# Altium schematic sheet ESP32_WiFi.SchDoc: BluetoothGateway
size A; DrawnBy: Q.Thang & T.Khoa; Revision: V1.0.0; SheetNumber: 7; SheetTotal: 17
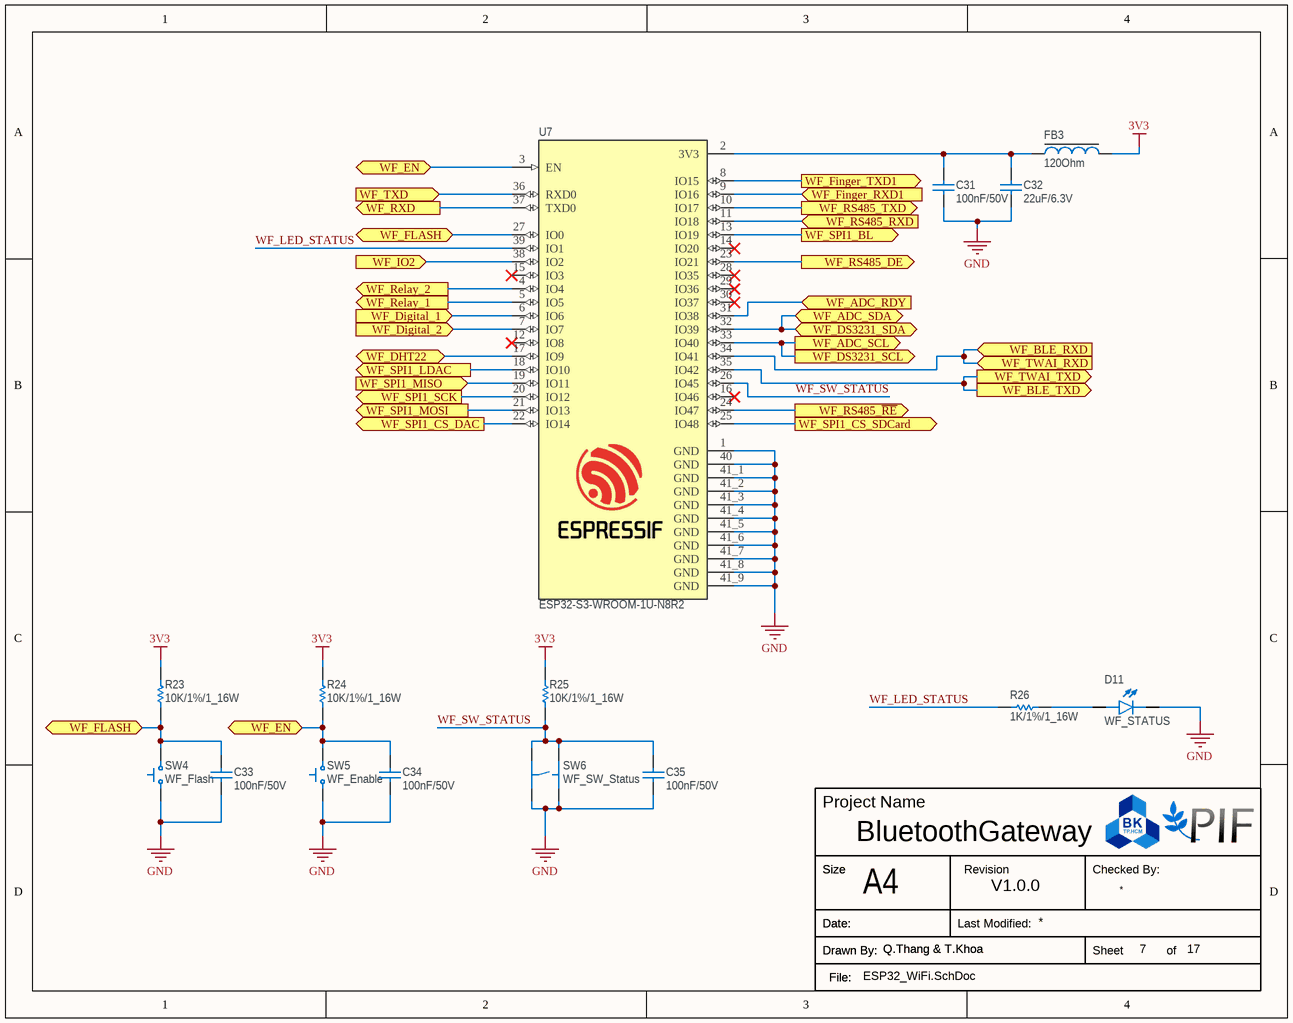
[diagram p0: ESP32_WiFi.SchDoc]

## Parts
C31  100nF/50V  [CAP_0805]
C32  22uF/6.3V  [CAP_0805]
C33  100nF/50V  [CAP_0402]
C34  100nF/50V  [CAP_0402]
C35  100nF/50V  [CAP_0402]
D11  WF_STATUS  [LED_0603Y]
FB3  120Ohm  [Ferrite_Bead_0805]
R23  10K/1%/1_16W  [RESISTOR_0402]
R24  10K/1%/1_16W  [RESISTOR_0402]
R25  10K/1%/1_16W  [RESISTOR_0402]
R26  1K/1%/1_16W  [RESISTOR_0402]
SW4  WF_Flash  [Button_3x4mm_SMD_2P]
SW5  WF_Enable  [Button_3x4mm_SMD_2P]
SW6  WF_SW_Status  [Button_4.5x4.7mm_SMD_4P]
U7  ESP32-S3-WROOM-1U-N8R2  [XCVR_ESP32-S3-WROOM-1U-N16R8]

## Ports
WF_ADC_RDY (in, see Overview_Schematic[6C], DAC_ADC_External[3A]), WF_ADC_SCL (out, see Overview_Schematic[6C], DAC_ADC_External[1A]), WF_ADC_SDA (bidir, see Overview_Schematic[6C], DAC_ADC_External[1A]), WF_BLE_RXD (in, see Overview_Schematic[5B], Communication[3C]), WF_BLE_TXD (out, see Overview_Schematic[5B], Communication[3C]), WF_DHT22 (bidir, see Overview_Schematic[6B], Interface_IO[4C]), WF_Digital_1 (in, see Overview_Schematic[6B], Interface_IO[7A]), WF_Digital_2 (in, see Overview_Schematic[6B], Interface_IO[7B]), WF_DS3231_SCL (out, see Overview_Schematic[6B], Interface_IO[1C]), WF_DS3231_SDA (bidir, see Overview_Schematic[6B], Interface_IO[1C]), WF_EN (bidir, see Overview_Schematic[5A], USB_To_TTL[4D]), WF_Finger_RXD1 (in, see Overview_Schematic[6B], FingerPrint[1B]), WF_Finger_TXD1 (out, see Overview_Schematic[6A], FingerPrint[1B]), WF_FLASH (bidir, see Overview_Schematic[5A], USB_To_TTL[4D]), WF_IO2 (in, see Overview_Schematic[5A], USB_To_TTL[4D]), WF_Relay_1 (out, see Overview_Schematic[6B], Interface_IO[1A]), WF_Relay_2 (out, see Overview_Schematic[6B], Interface_IO[1B]), WF_RS485_DE (out, see Overview_Schematic[6B], UART_RS485[1B]), WF_RS485_RXD (in, see Overview_Schematic[6B], UART_RS485[1B]), WF_RS485_TXD (out, see Overview_Schematic[6B], UART_RS485[1B]), WF_RS485_~{RE} (out, see Overview_Schematic[6B], UART_RS485[1B]), WF_RXD (out, see Overview_Schematic[5A], USB_To_TTL[6C]), WF_SPI1_BL (out, see Overview_Schematic[5C], Display[2D]), WF_SPI1_CS_DAC (out, see Overview_Schematic[5C], DAC_ADC_External[1C]), WF_SPI1_CS_SDCard (out, see Overview_Schematic[5C], Display[2C]), WF_SPI1_LDAC (out, see Overview_Schematic[5C], DAC_ADC_External[1C]), WF_SPI1_MISO (in, see Overview_Schematic[5C], Display[2C]), WF_SPI1_MOSI (out, see Overview_Schematic[5C], DAC_ADC_External[1C], Display[2C]), WF_SPI1_SCK (out, see Overview_Schematic[5C], DAC_ADC_External[1C], Display[2C]), WF_TWAI_RXD (in, see Overview_Schematic[5B]), WF_TWAI_TXD (out, see Overview_Schematic[5B]), WF_TXD (in, see Overview_Schematic[5A], USB_To_TTL[6C])

## Nets
3V3: FB3.2 R23.2 R24.2 R25.2
GND: C31.1 C32.1 C33.1 C34.1 C35.1 D11.C SW4.1 SW5.1 SW6.1 SW6.3 U7.1(GND) U7.40(GND) U7.41_1(GND) U7.41_2(GND) U7.41_3(GND) U7.41_4(GND) U7.41_5(GND) U7.41_6(GND) U7.41_7(GND) U7.41_8(GND) U7.41_9(GND)
WF_ADC_RDY: U7.31(IO38) ; port WF_ADC_RDY
WF_ADC_SCL: U7.33(IO40) ; port WF_ADC_SCL, port WF_DS3231_SCL
WF_ADC_SDA: U7.32(IO39) ; port WF_ADC_SDA, port WF_DS3231_SDA
WF_BLE_RXD: U7.34(IO41) ; port WF_TWAI_RXD, port WF_BLE_RXD
WF_BLE_TXD: U7.35(IO42) ; port WF_TWAI_TXD, port WF_BLE_TXD
WF_DHT22: U7.17(IO9) ; port WF_DHT22
WF_Digital_1: U7.6(IO6) ; port WF_Digital_1
WF_Digital_2: U7.7(IO7) ; port WF_Digital_2
WF_EN: C34.2 R24.1 SW5.2 U7.3(EN) ; port WF_EN
WF_Finger_RXD1: U7.9(IO16) ; port WF_Finger_RXD1
WF_Finger_TXD1: U7.8(IO15) ; port WF_Finger_TXD1
WF_FLASH: C33.2 R23.1 SW4.2 U7.27(IO0) ; port WF_FLASH
WF_IO2: U7.38(IO2) ; port WF_IO2
WF_LED_STATUS: R26.1 U7.39(IO1)
WF_Relay_1: U7.5(IO5) ; port WF_Relay_1
WF_Relay_2: U7.4(IO4) ; port WF_Relay_2
WF_RS485_DE: U7.23(IO21) ; port WF_RS485_DE
WF_RS485_~{RE}: U7.24(IO47) ; port WF_RS485_~{RE}
WF_RS485_RXD: U7.11(IO18) ; port WF_RS485_RXD
WF_RS485_TXD: U7.10(IO17) ; port WF_RS485_TXD
WF_RXD: U7.37(TXD0) ; port WF_RXD
WF_SPI1_BL: U7.13(IO19) ; port WF_SPI1_BL
WF_SPI1_CS_DAC: U7.22(IO14) ; port WF_SPI1_CS_DAC
WF_SPI1_CS_SDCard: U7.25(IO48) ; port WF_SPI1_CS_SDCard
WF_SPI1_LDAC: U7.18(IO10) ; port WF_SPI1_LDAC
WF_SPI1_MISO: U7.19(IO11) ; port WF_SPI1_MISO
WF_SPI1_MOSI: U7.21(IO13) ; port WF_SPI1_MOSI
WF_SPI1_SCK: U7.20(IO12) ; port WF_SPI1_SCK
WF_SW_STATUS: C35.2 R25.1 SW6.2 SW6.4 U7.26(IO45)
WF_TXD: U7.36(RXD0) ; port WF_TXD
NetC31_2: C31.2 C32.2 FB3.1 U7.2(3V3)
NetD11_A: D11.A R26.2

Not connected (* = marked no-connect by the designer): U7 12(IO8)* 14(IO20)* 15(IO3)* 16(IO46)* 28(IO35)* 29(IO36)* 30(IO37)*

## Notes on the sheet
- Project Name
- Size
- A4
- Revision
- Checked By:
- Drawn By:
- Date:
- File:
- Last Modified:
- Sheet
- of

## Library data of the parts
C31 = Ceramic_Cap_100nF_50V_0805: CAP, size 0805, 100nF, 50V; Supply Part Number: Tụ Gốm 0805 100nF (0.1uF) 50V; Supply Name: Thegioiic; Datasheet: *; Supply URL: https://www.thegioiic.com/tu-gom-0805-100nf-0-1uf-50v
C32 = Ceramic_Cap_22uF_6.3V_0805: CAP, size 0805, 22uF, 6.3V; Supply Part Number: Tụ Gốm 0805 22uF 6.3V; Supply Name: Thegioiic; Datasheet: *; Supply URL: https://www.thegioiic.com/tu-gom-0805-22uf-6-3v
C33-C35 = Ceramic_Cap_100nF_50V_0402: CAP, size 0402, 100nF, 50V; Supply Part Number: Tụ Gốm 0402 100nF (0.1uF) 50V; Supply Name: Thegioiic; Datasheet: *; Supply URL: https://www.thegioiic.com/tu-gom-0402-100nf-0-1uf-50v
D11 = LED_Yellow_0603: LED Yellow 0603; Supply Part Number: LED Vàng 0603 Dán SMD Trong Suốt Harvatek; Supply Name: Thegioiic; Supply URL: https://www.thegioiic.com/led-vang-0603-dan-smd-trong-suot-harvatek
FB3 = Ferrite_Bead_120Ohm_2A_0805: Ferrite Bead, size 0805, 120Ohm, 2A; Supply Part Number: CBW201209U121T Ferrite Beads 2A 120 Ohm 0805; Supply Name: Thegioiic; Supply URL: https://www.thegioiic.com/cbw201209u121t-ferrite-beads-2a-120-ohm-0805
R23-R25 = Res_10K_0402_1%: Resistor 0402 10KOhm 1% 1_16W; Supply Part Number: Điện Trở 10 KOhm 0402 1%; Supply Name: Thegioiic; Supply URL: https://www.thegioiic.com/dien-tro-10-kohm-0402-1-
R26 = Res_1K_0402_1%: Resistor 0402 1KOhm 1% 1_16W; Supply Part Number: Điện Trở 1 KOhm 0402 1%; Supply Name: Thegioiic; Supply URL: https://www.thegioiic.com/dien-tro-1-kohm-0402-1-
SW4 SW5 = Button_SMD_3x4mm_2P: Supply Part Number: Nút Nhấn 3x4mm Cao 2.5mm 2 Chân SMD; Supply Name: Thegioiic; Datasheet: *; Supply URL: https://www.thegioiic.com/nut-nhan-3x4mm-cao-2-5mm-2-chan-smd
SW6 = Button_SMD_4.5x4.7mm_4P: Supply Part Number: Nút Nhấn Rùa 4.5x4.7mm Cao 1.65mm 4 Chân SMD; Supply Name: Thegioiic; Datasheet: *; Supply URL: https://www.thegioiic.com/nut-nhan-rua-4-5x4-7mm-cao-1-65mm-4-chan-smd
U7 = ESP32-S3-WROOM-1U-N8R2: Bluetooth, WiFi 802.11b/g/n, Bluetooth v5.0 Transceiver Module 2.4GHz Antenna Not Included, U.FL Surface Mount; Supply Part Number: ESP32-S3-WROOM-1U-N8R2 Module WiFi Bluetooth 8MB Flash, 2MB SRAM 2.4GHz; Supply Name: Thegioiic; Datasheet: https://www.espressif.com/sites/default/files/documentation/esp32-s3_datasheet_en.pdf; Supply URL: https://www.thegioiic.com/esp32-s3-wroom-1u-n8r2-module-wifi-bluetooth-8mb-flash-2mb-sram-2-4ghz